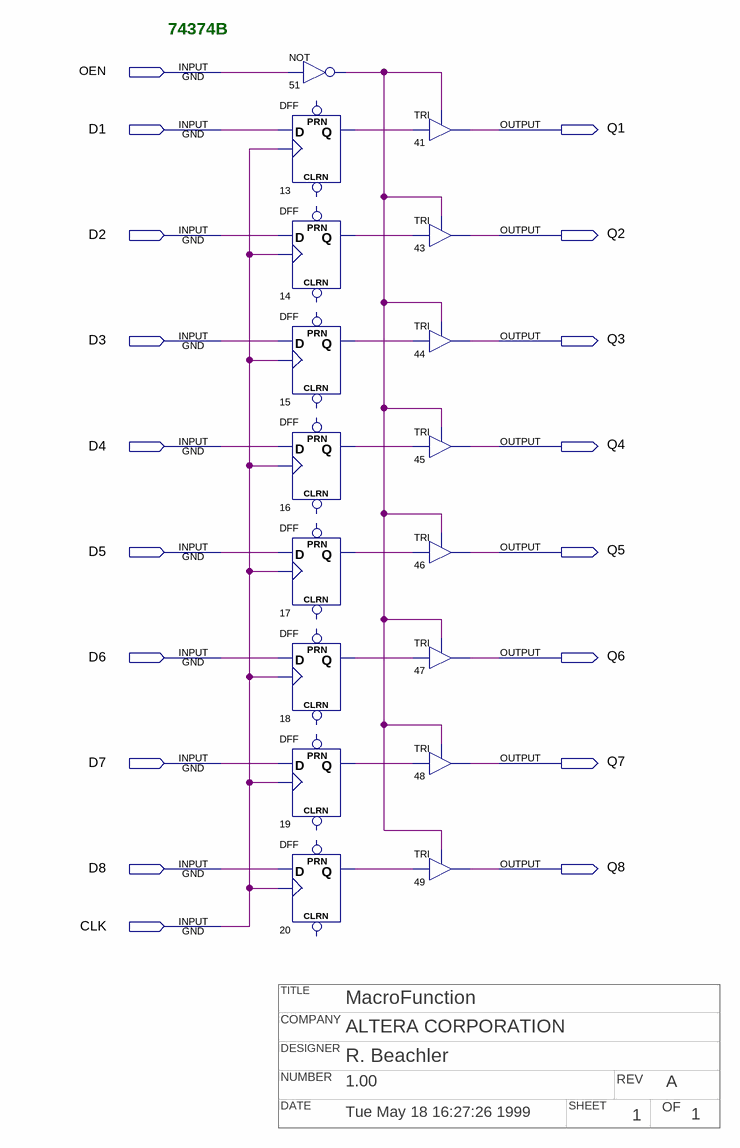
[diagram p0: schematic sheet]
// Quartus schematic 74374b.bdf as structural Verilog: 17 symbols, 18 pins
// Title block: TITLE: MacroFunction; COMPANY: ALTERA CORPORATION; DESIGNER: R. Beachler; NUMBER: 1.00; REV: A; DATE: Tue May 18 16:27:26 1999; SHEET: 1; OF: 1
module \74374b  (
  input  OEN,
  input  D1,
  input  D2,
  input  D3,
  input  D4,
  input  D5,
  input  D6,
  input  D7,
  input  D8,
  input  CLK,
  output Q1,
  output Q2,
  output Q3,
  output Q4,
  output Q5,
  output Q6,
  output Q7,
  output Q8
);

  wire n13_q, n14_q, n15_q, n16_q, n17_q, n18_q, n19_q, n20_q, n51_out;

  not u_51 (n51_out, OEN);
  DFF u_13 (.CLK(CLK), .D(D1), .Q(n13_q));  // open: CLRN, PRN
  DFF u_14 (.CLK(CLK), .D(D2), .Q(n14_q));  // open: CLRN, PRN
  DFF u_15 (.CLK(CLK), .D(D3), .Q(n15_q));  // open: CLRN, PRN
  DFF u_16 (.CLK(CLK), .D(D4), .Q(n16_q));  // open: CLRN, PRN
  DFF u_17 (.CLK(CLK), .D(D5), .Q(n17_q));  // open: CLRN, PRN
  DFF u_18 (.CLK(CLK), .D(D6), .Q(n18_q));  // open: CLRN, PRN
  DFF u_19 (.CLK(CLK), .D(D7), .Q(n19_q));  // open: CLRN, PRN
  DFF u_20 (.CLK(CLK), .D(D8), .Q(n20_q));  // open: CLRN, PRN
  TRI u_41 (.IN(n13_q), .OE(n51_out), .OUT(Q1));
  TRI u_43 (.IN(n14_q), .OE(n51_out), .OUT(Q2));
  TRI u_44 (.IN(n15_q), .OE(n51_out), .OUT(Q3));
  TRI u_45 (.IN(n16_q), .OE(n51_out), .OUT(Q4));
  TRI u_46 (.IN(n17_q), .OE(n51_out), .OUT(Q5));
  TRI u_47 (.IN(n18_q), .OE(n51_out), .OUT(Q6));
  TRI u_48 (.IN(n19_q), .OE(n51_out), .OUT(Q7));
  TRI u_49 (.IN(n20_q), .OE(n51_out), .OUT(Q8));

  // Notes on the sheet:
  //   74374B
endmodule
